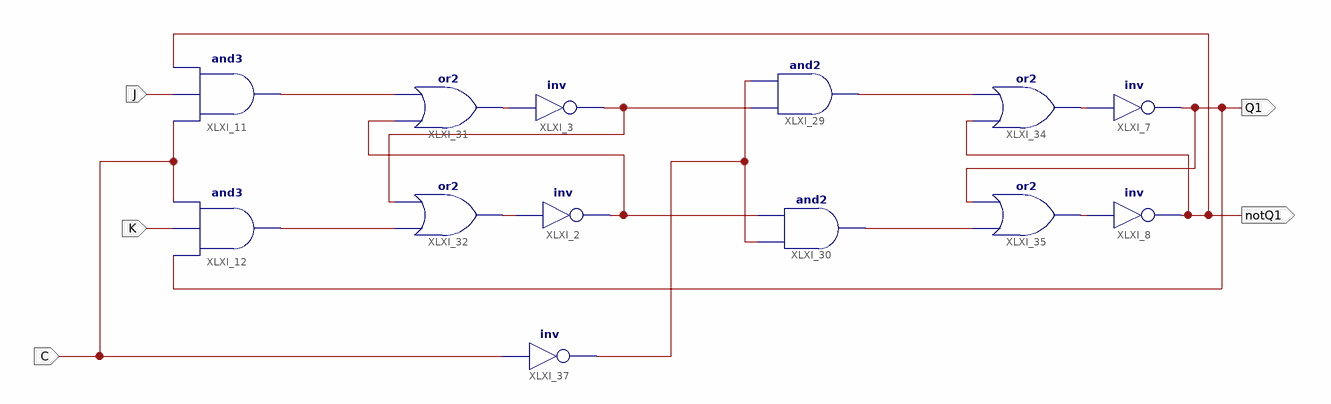
[diagram p0: schematic sheet 1]
// Xilinx ISE schematic SchemCounter.sch (virtex5) as structural Verilog: 13 symbols, 5 ports
module SchemCounter (
  input  J,
  input  K,
  input  C,
  output notQ1,
  output Q1
);

  wire XLXN_18, XLXN_19, XLXN_63, XLXN_73, XLXN_75, XLXN_76, XLXN_83, XLXN_90, XLXN_92, XLXN_96, XLXN_102;

  not XLXI_2 (XLXN_90, XLXN_19);
  not XLXI_3 (XLXN_92, XLXN_18);
  and XLXI_12 (XLXN_73, Q1, K, C);
  and XLXI_11 (XLXN_63, C, J, notQ1);
  not XLXI_8 (notQ1, XLXN_76);
  not XLXI_7 (Q1, XLXN_75);
  and XLXI_29 (XLXN_83, XLXN_92, XLXN_102);
  and XLXI_30 (XLXN_96, XLXN_102, XLXN_90);
  or XLXI_31 (XLXN_18, XLXN_90, XLXN_63);
  or XLXI_32 (XLXN_19, XLXN_73, XLXN_92);
  or XLXI_34 (XLXN_75, notQ1, XLXN_83);
  or XLXI_35 (XLXN_76, XLXN_96, Q1);
  not XLXI_37 (XLXN_102, C);
endmodule
